# EAGLE design brick_analog_led_smd (EAGLE 7.3.0)
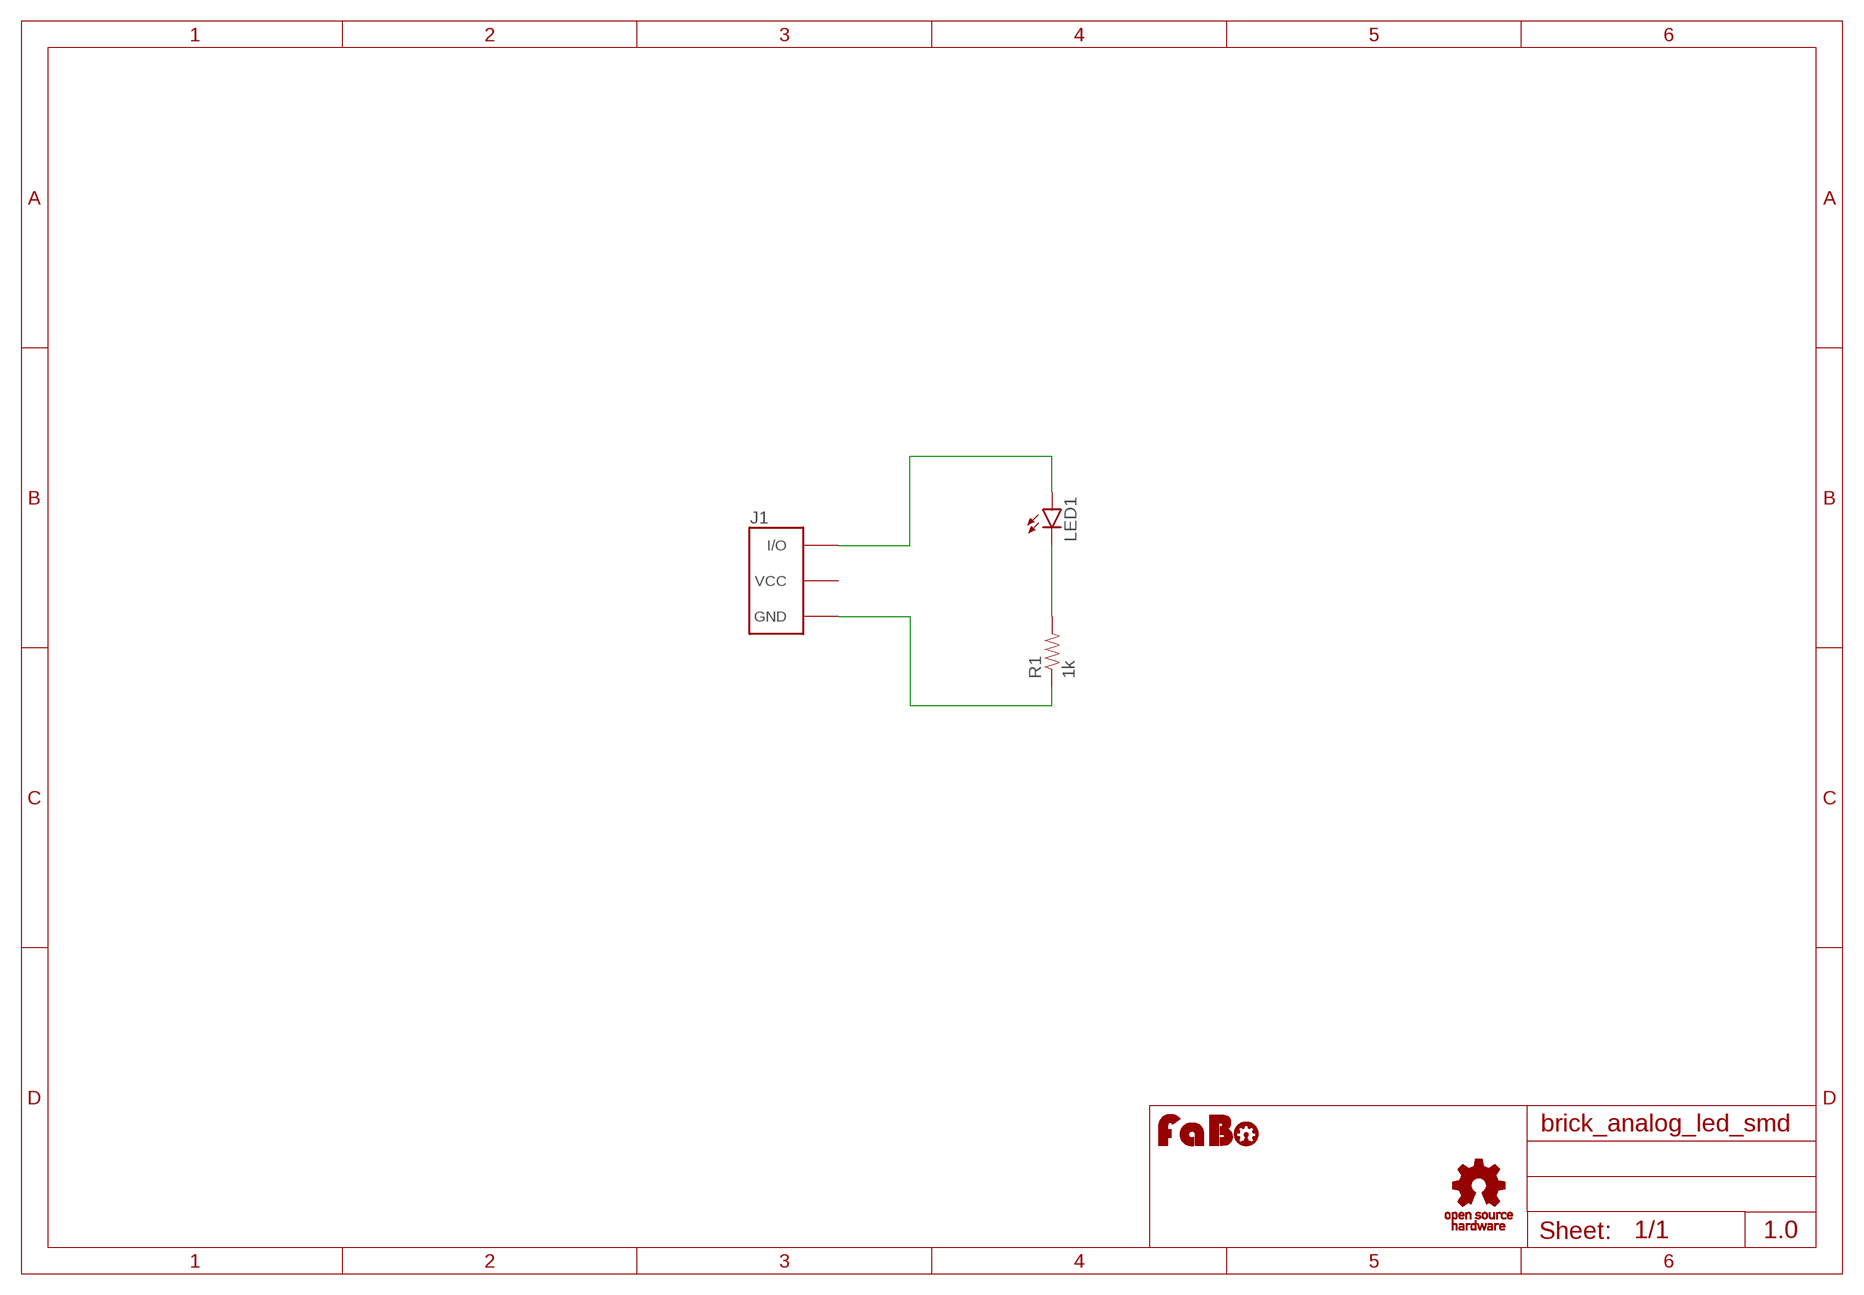
[diagram p0: schematic, sheet 1]

## Parts
J1  BRICK_3PIN_NORMAL  [BRICK_3PIN]
LED1  LED-EIA0603  [EIA0603-LED]
R1  1k  RES-EIA0603  [EIA0603]
U$2  LOGO_FABO-M  [LOGO_FABO_M]
U$4  LOGO_OSHW_T-M  [LOGO_OSHW_T_M]

## Nets
GND: J1.GND R1.1
N$1: J1.IN/OUT(I/O) LED1.A
N$3: LED1.C R1.2
Unconnected: J1.VCC

## Notes on the sheet
- 1.0

## Library data of the parts
J1 = Gclue:BRICK_3PIN: FaBo Brick 3pin
LED1 = Gclue:LED: LED
R1 = Gclue:RES
U$2 = FaBo:LOGO_FABO
U$4 = Gclue:LOGO_OSHW_T

## Board
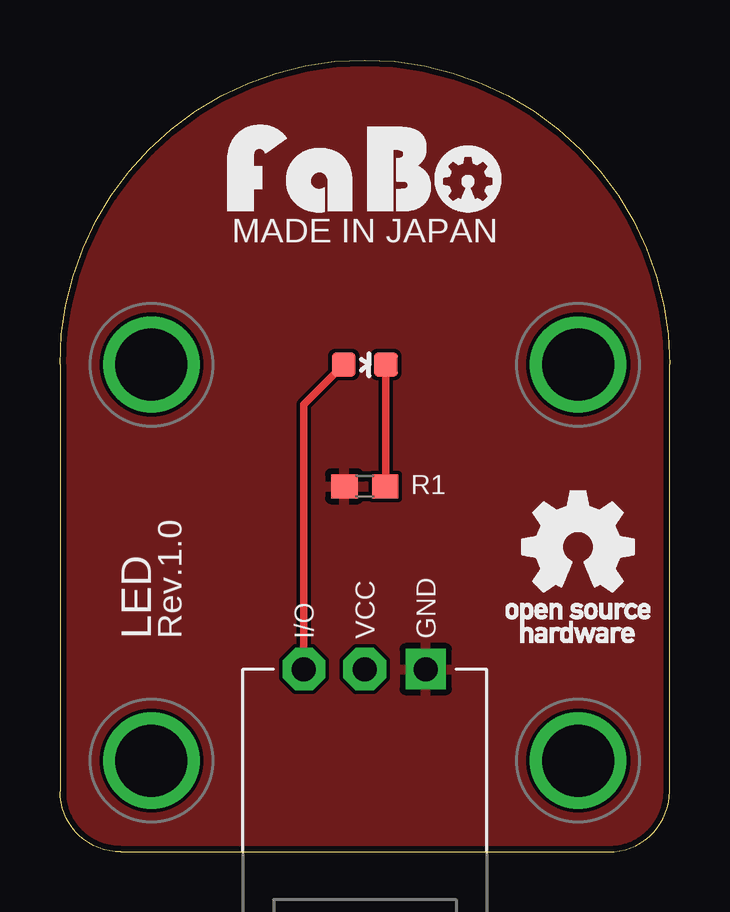
[diagram p1: board, top side]
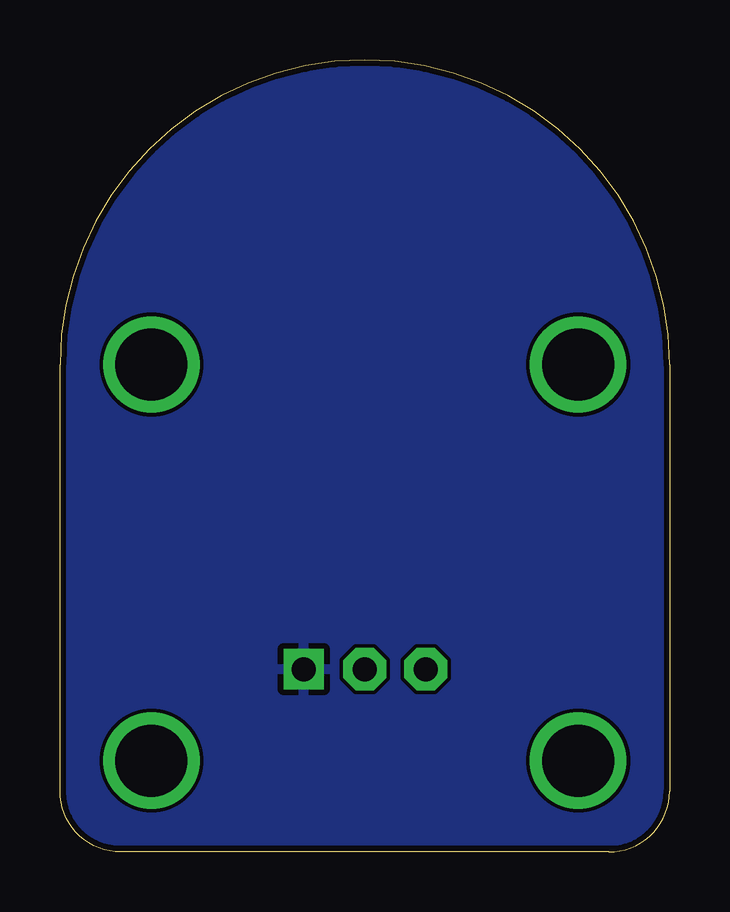
[diagram p2: board, bottom side, seen from below]

Size 25.4 x 33.02 mm. Coordinates in mm from the lower left corner, seen from the top.
Copper layers (1*16): Top 0.035mm / dielectric 1.5mm / Bottom 0.035mm
Design rules "Elecrow_2-layer_eagle_rule": minimum track width 6mil, minimum drill 12mil, track to track 6mil, track to pad 6mil, pad to pad 6mil, via to via 6mil, smd to smd 0mil, copper to edge 10mil, drill to drill 10mil, minimum pad ring 10mil, minimum via ring 6mil, stop-mask expansion 2mil, vias tented up to drill 100mil, thermal gap 10mil

### Footprints (pad centres in the part's own frame; a part is rotated, then mirrored left to right if it is on the bottom)
BRICK_3PIN = drill 1 pad 1.676 square: GND 2.54,-8.89 | drill 1 pad 1.778 octagon: IN/OUT -2.54,-8.89; VCC 0,-8.89 | drill 3 pad 3.81: P$5 -8.89,3.81; P$6 8.89,3.81; P$7 -8.89,-12.7; P$8 8.89,-12.7
EIA0603-LED = smd 1 x 1: A 0,-0.877; C 0,0.877
EIA0603 = smd 1.1 x 1: 1 -0.85,0; 2 0.85,0

### Placement (x,y rotation side)
J1  12.7,16.51 0 top
LED1  12.7,20.32 270 top
R1  12.7,15.24 0 top
U$2  12.7,26.67 0 top
U$4  21.59,12.7 0 top

### Tracks (layer width: path | path; a pad name or v marks a point on that pad's centre or on a via)
GND
  pour Bottom: -1.27,-1.27 26.67,-1.27 26.67,34.29 -1.27,34.29
  pour Top: -1.27,-1.27 26.67,-1.27 26.67,34.29 -1.27,34.29
N$1
  Top 0.305: J1.IN/OUT 10.16,18.66 LED1.A
N$3
  Top 0.305: LED1.C 13.58,15.27 R1.2

### Text on the board
tPlace: MADE IN JAPAN | LED | Rev.1.0